# Altium schematic sheet TraitementNumerique.SchDoc: Mini-Projet
size A4 portrait; Date: Février 2025; Author: Nolan Ronjon; CompanyName: Coordonnées; Address1: Nolan Ronjon; Address2: 21302313; Address3: L2 DM-IEEA; Address4: nolan.ronjon@etu.sorbonne-universite.fr; DocumentNumber: Schematic.SchDoc; Revision: 1.0; SheetNumber: 2; SheetTotal: 2; ProjectTitle: LU2EE20A; SPICEModelCacheHFZDDCNV: <root> / <DocumentId>HFZDDCNV</DocumentId> / </root>
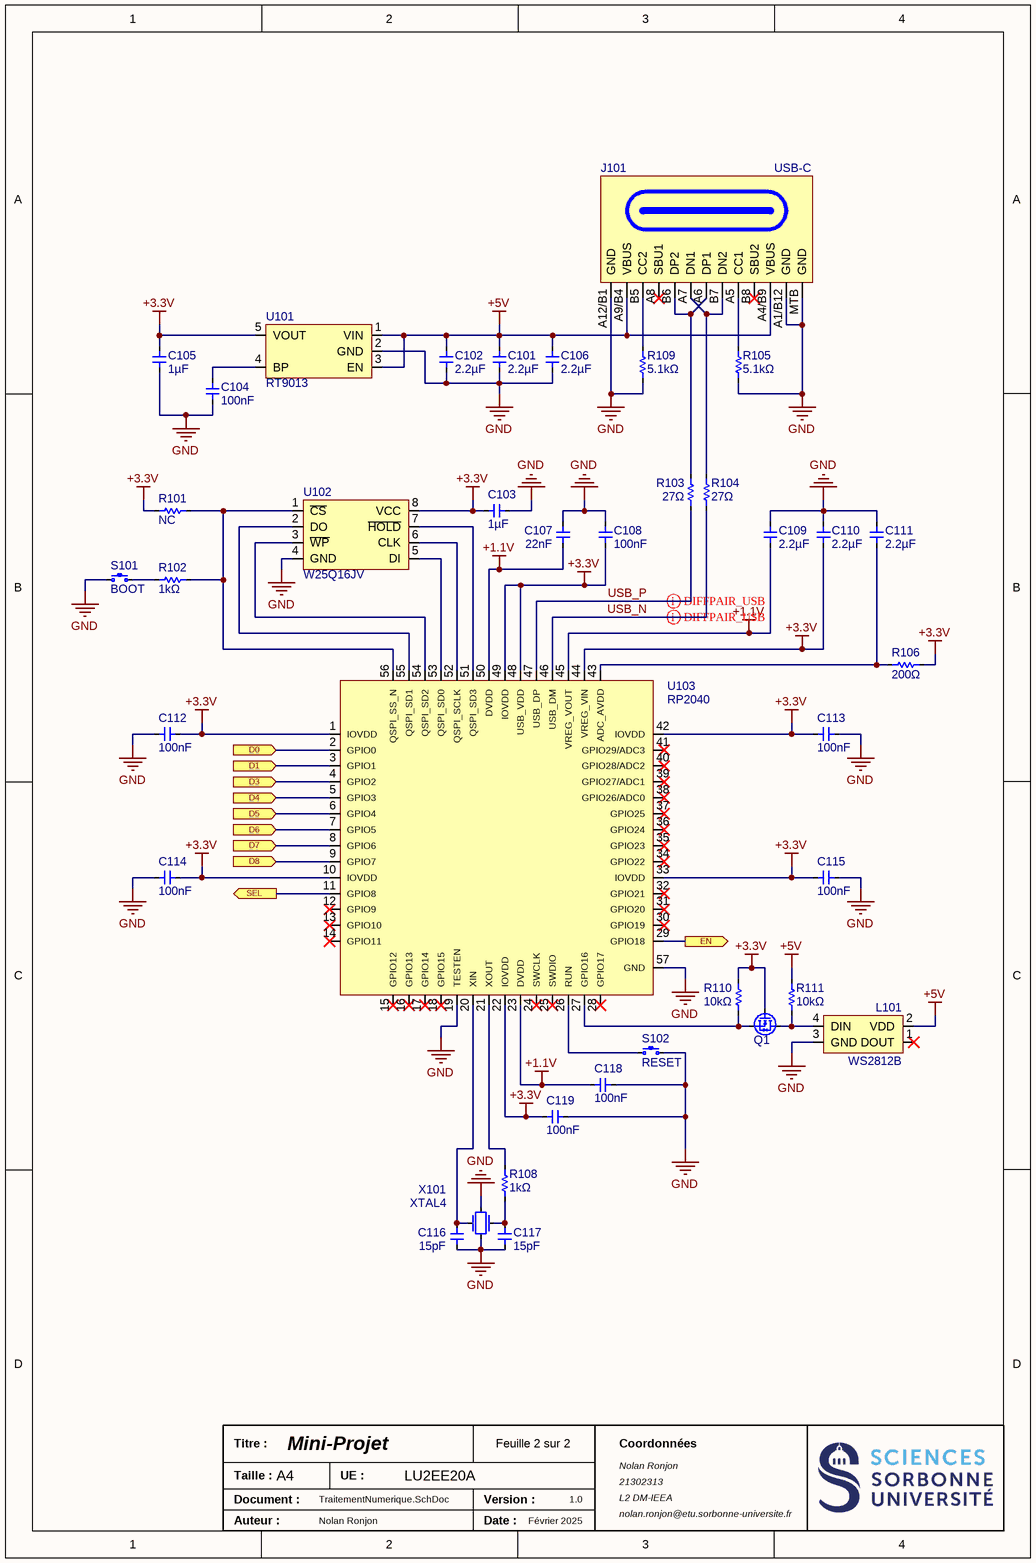
[diagram p0: TraitementNumerique.SchDoc]

## Parts
C101  value 2.2µF  [0603]  (hidden comment: Condensateur)
C102  value 2.2µF  [0603]  (hidden comment: Condensateur)
C103  value 1µF  [0603]  (hidden comment: Condensateur)
C104  value 100nF  [0603]  (hidden comment: Condensateur)
C105  value 1µF  [0603]  (hidden comment: Condensateur)
C106  value 2.2µF  [0603]  (hidden comment: Condensateur)
C107  value 22nF  [0603]  (hidden comment: Condensateur)
C108  value 100nF  [0603]  (hidden comment: Condensateur)
C109  value 2.2µF  [0603]  (hidden comment: Condensateur)
C110  value 2.2µF  [0603]  (hidden comment: Condensateur)
C111  value 2.2µF  [0603]  (hidden comment: Condensateur)
C112  value 100nF  [0603]  (hidden comment: Condensateur)
C113  value 100nF  [0603]  (hidden comment: Condensateur)
C114  value 100nF  [0603]  (hidden comment: Condensateur)
C115  value 100nF  [0603]  (hidden comment: Condensateur)
C116  value 15pF  [0603]  (hidden comment: Condensateur)
C117  value 15pF  [0603]  (hidden comment: Condensateur)
C118  value 100nF  [0603]  (hidden comment: Condensateur)
C119  value 100nF  [0603]  (hidden comment: Condensateur)
J101  USB-C  [USB-C]
L101  WS2812B  [SMD1615]
Q1  2N7002  [SOT-23]  (value not drawn)
R101  value NC  [0603]  (hidden comment: Resistance)
R102  value 1kΩ  [0603]  (hidden comment: Resistance)
R103  value 27Ω  [0603]  (hidden comment: Resistance)
R104  value 27Ω  [0603]  (hidden comment: Resistance)
R105  value 5.1kΩ  [0603]  (hidden comment: Resistance)
R106  value 200Ω  [0603]  (hidden comment: Resistance)
R108  value 1kΩ  [0603]  (hidden comment: Resistance)
R109  value 5.1kΩ  [0603]  (hidden comment: Resistance)
R110  value 10kΩ  [0603]  (hidden comment: Resistance)
R111  value 10kΩ  [0603]  (hidden comment: Resistance)
S101  BOOT  [Bouton]
S102  RESET  [Bouton]
U101  RT9013  [SOT-23-5]
U102  W25Q16JV  [USON-8]
U103  RP2040  [QFN-56]
X101  XTAL4  [SMD3225]

## Ports
D0 (in, see TraitementAnalogique[3C]), D1 (in, see TraitementAnalogique[3C]), D3 (in, see TraitementAnalogique[3C]), D4 (in, see TraitementAnalogique[3C]), D5 (in, see TraitementAnalogique[3C]), D6 (in, see TraitementAnalogique[3C]), D7 (in, see TraitementAnalogique[3C]), D8 (in, see TraitementAnalogique[3C]), EN (out, see TraitementAnalogique[3C]), SEL (out, see TraitementAnalogique[3C])

## Nets
+1.1V: C107.2 C109.2 C118.2 U103.23(DVDD) U103.45(VREG_VOUT) U103.50(DVDD)
+3.3V: C103.2 C105.1 C108.2 C110.2 C112.2 C113.2 C114.2 C115.2 C119.2 Q1.1(G) R101.2 R106.1 R110.2 U101.5(VOUT) U102.8(VCC) U103.1(IOVDD) U103.10(IOVDD) U103.22(IOVDD) U103.33(IOVDD) U103.42(IOVDD) U103.44(VREG_VIN) U103.48(USB_VDD) U103.49(IOVDD)
+5V: C101.1 C102.1 C106.1 J101.A4/B9(VBUS) J101.A9/B4(VBUS) L101.2(VDD) R111.2 U101.1(VIN) U101.3(EN)
GND: C101.2 C102.2 C103.1 C104.2 C105.2 C106.2 C107.1 C108.1 C109.1 C110.1 C111.1 C112.1 C113.1 C114.1 C115.1 C116.2 C117.2 C118.1 C119.1 J101.A1/B12(GND) J101.A12/B1(GND) J101.MTB(GND) L101.3(GND) R105.1 R109.1 S101.1 S102.2 U101.2(GND) U102.4(GND) U103.19(TESTEN) U103.57(GND) X101.2(GND_1) X101.4(GND_2)
D0: U103.2(GPIO0) ; port D0
D1: U103.3(GPIO1) ; port D1
D3: U103.4(GPIO2) ; port D3
D4: U103.5(GPIO3) ; port D4
D5: U103.6(GPIO4) ; port D5
D6: U103.7(GPIO5) ; port D6
D7: U103.8(GPIO6) ; port D7
D8: U103.9(GPIO7) ; port D8
EN: U103.29(GPIO18) ; port EN
SEL: U103.11(GPIO8) ; port SEL
USB_N: R104.1 U103.46(USB_DM)
USB_P: R103.1 U103.47(USB_DP)
NetC104_1: C104.1 U101.4(BP)
NetC111_2: C111.2 R106.2 U103.43(ADC_AVDD)
NetC116_1: C116.1 U103.20(XIN) X101.1(CRYSTAL_1)
NetC117_1: C117.1 R108.1 X101.3(CRYSTAL_2)
NetJ101_A5: J101.A5(CC1) R105.2
NetJ101_A6: J101.A6(DP1) J101.B6(DP2) R103.2
NetJ101_A7: J101.A7(DN1) J101.B7(DN2) R104.2
NetJ101_B5: J101.B5(CC2) R109.2
NetL101_4: L101.4(DIN) Q1.3(D) R111.1
NetQ1_2: Q1.2(S) R110.1 U103.27(GPIO16)
NetR101_1: R101.1 R102.1 U102.1(~{CS}) U103.56(QSPI_SS_N)
NetR102_2: R102.2 S101.2
NetR108_2: R108.2 U103.21(XOUT)
NetS102_1: S102.1 U103.26(RUN)
NetU102_2: U102.2(DO) U103.55(QSPI_SD1)
NetU102_3: U102.3(~{WP}) U103.54(QSPI_SD2)
NetU102_5: U102.5(DI) U103.53(QSPI_SD0)
NetU102_6: U102.6(CLK) U103.52(QSPI_SCLK)
NetU102_7: U102.7(~{HOLD}) U103.51(QSPI_SD3)

Not connected (* = marked no-connect by the designer): J101 A8(SBU1)* B8(SBU2)*; L101 1(DOUT)*; U103 12(GPIO9)* 13(GPIO10)* 14(GPIO11)* 15(GPIO12)* 16(GPIO13)* 17(GPIO14)* 18(GPIO15)* 24(SWCLK)* 25(SWDIO)* 28(GPIO17)* 30(GPIO19)* 31(GPIO20)* 32(GPIO21)* 34(GPIO22)* 35(GPIO23)* 36(GPIO24)* 37(GPIO25)* 38(GPIO26/ADC0)* 39(GPIO27/ADC1)* 40(GPIO28/ADC2)* 41(GPIO29/ADC3)*

## Layout directives
differential pair: USB_N, USB_P

## Notes on the sheet
- Titre :
- Taille :
- Auteur :
- Document :
- A4
- UE :
- Date :
- Version :

## Library data of the parts
J101 = USB-C: Connecteur; Manufacturer Part: TYPE-C-31-M-12; JLCPCB Part: C165948
L101 = WS2812B: LED RGB; Manufacturer Part: XL-1615RGBC-WS2812B; JLCPCB Part: C5349954
Q1 = 2N7002: MOSFET; Manufacturer Part: 2N7002K-7; JLCPCB Part: C85047
S101 S102 = Bouton: Manufacturer Part: TS-1088-AR02016; JLCPCB Part: C720477
U101 = RT9013: Régulateur de tension; Manufacturer Part: RT9013-33GB; JLCPCB Part: C47773
U102 = W25Q16JV: Flash; Manufacturer Part: W25Q16JVUXIQ; JLCPCB Part: C2843335
U103 = RP2040: Microcontroleur; Manufacturer Part: RP2040; JLCPCB Part: C2040
X101 = XTAL4: Crystal; Manufacturer Part: ABM8-272-T3; Value: 12MHz; JLCPCB Part: C20625731